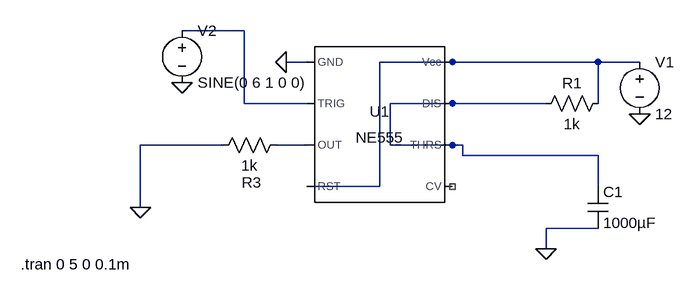
[diagram p0: schematic project_2.asc]
project_2.asc, the LTspice schematic file:
Version 4
SHEET 1 880 680
WIRE 0 32 -96 32
WIRE 96 80 64 80
WIRE 320 80 208 80
WIRE 544 80 320 80
WIRE 608 80 544 80
WIRE 0 144 0 32
WIRE 96 144 0 144
WIRE 320 144 224 144
WIRE 464 144 320 144
WIRE 544 144 544 80
WIRE -32 208 -160 208
WIRE 96 208 48 208
WIRE 224 208 224 144
WIRE 320 208 224 208
WIRE 336 208 320 208
WIRE 336 224 336 208
WIRE 544 224 336 224
WIRE 208 272 208 80
WIRE 208 272 96 272
WIRE 544 272 544 224
WIRE -160 304 -160 208
WIRE 544 336 464 336
WIRE 464 368 464 336
FLAG 64 80 0
FLAG 608 160 0
FLAG 464 368 0
FLAG -160 304 0
FLAG -96 112 0
SYMBOL Misc\\NE555 208 176 R0
SYMATTR InstName U1
SYMBOL voltage 608 64 R0
WINDOW 123 0 0 Left 0
WINDOW 39 0 0 Left 0
SYMATTR InstName V1
SYMATTR Value 12
SYMBOL res 560 128 R90
WINDOW 0 0 56 VBottom 2
WINDOW 3 32 56 VTop 2
SYMATTR InstName R1
SYMATTR Value 1k
SYMBOL cap 528 272 R0
SYMATTR InstName C1
SYMATTR Value 1000µF
SYMBOL res 64 192 R90
WINDOW 0 89 53 VBottom 2
WINDOW 3 32 56 VTop 2
SYMATTR InstName R3
SYMATTR Value 1k
SYMBOL voltage -96 16 R0
WINDOW 123 0 0 Left 0
WINDOW 39 0 0 Left 0
SYMATTR InstName V2
SYMATTR Value SINE(0 6 1 0 0)
TEXT -344 392 Left 2 !.tran 0 5 0 0.1m

The netlist it stands for:
* project_2.asc
XU1 0 N001 N004 N002 NC_01 N003 N003 N002 NE555  ; pins GND TRIG OUT RST CV THRS DIS Vcc
V1 N002 0 12
R1 N002 N003 1k
C1 N003 0 1000µF
R3 N004 0 1k
V2 N001 0 SINE(0 6 1 0 0)
.tran 0 5 0 0.1m
.lib NE555.sub
.backanno
.end